# Altium schematic sheet TPS65130.schdoc
size A2
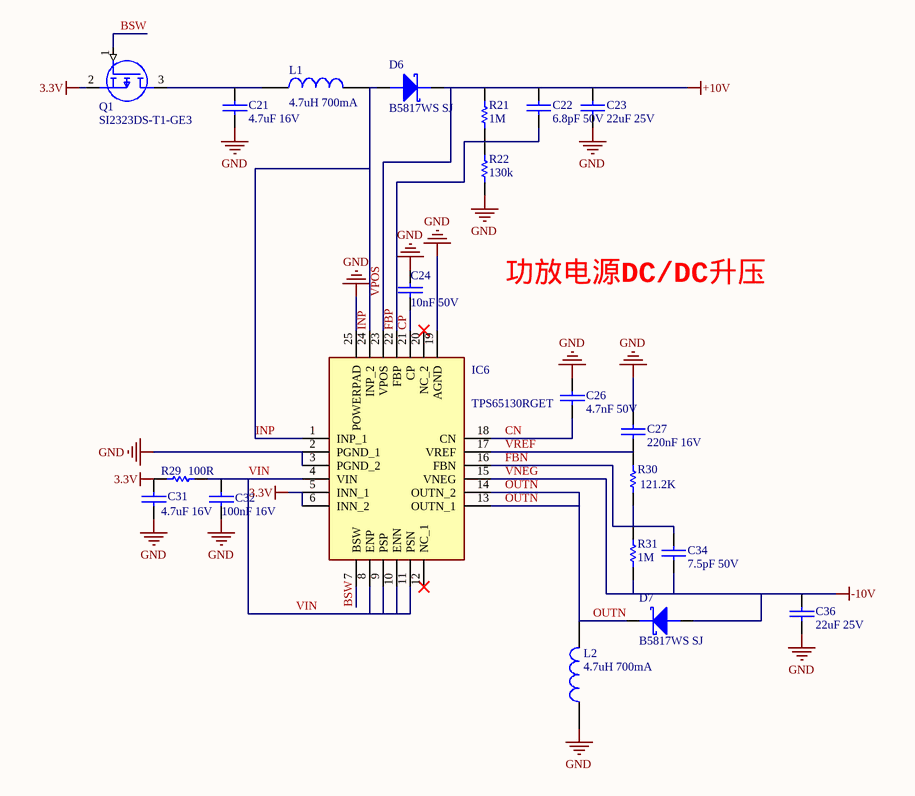
[diagram p0: TPS65130.schdoc]

## Parts
C21  4.7uF 16V  [0603C]
C22  6.8pF 50V  [0402C]
C23  22uF 25V  [0805C]
C24  10nF 50V  [0402C]
C26  4.7nF 50V  [0402C]
C27  220nF 16V  [0402C]
C31  4.7uF 16V  [0603C]
C32  100nF 16V  [0402C]
C34  7.5pF 50V  [0402C]
C36  22uF 25V  [0805C]
D6  B5817WS SJ  [SOD-323]
D7  B5817WS SJ  [SOD-323]
IC6  TPS65130RGET  [QFN50P400X400X100-25N]
L1  4.7uH 700mA  [0805L]
L2  4.7uH 700mA  [0805L]
Q1  SI2323DS-T1-GE3  [SOT95P237X112-3N]
R21  1M  [0402R]
R22  130k  [0402R]
R29  100R  [0402R]
R30  121.2K  [0402R]
R31  1M  [0402R]

## Nets
3.3V: C31.2 IC6.5(INN_1) IC6.6(INN_2) Q1.2(S) R29.1
GND: C21.1 C23.2 C24.1 C26.1 C27.2 C31.1 C32.2 C36.2 IC6.2(PGND_1) IC6.3(PGND_2) IC6.19(AGND) IC6.25(POWERPAD) L2.1 R22.1
VNEG: C34.1 C36.1 D7.A IC6.15(VNEG) R31.1  [also labelled -10V]
VPOS: C22.2 C23.1 D6.K IC6.23(VPOS) R21.2  [also labelled +10V]
BSW: IC6.7(BSW) Q1.1(G)
CN: C26.2 IC6.18(CN)
CP: C24.2 IC6.21(CP)
FBN: C34.2 IC6.16(FBN) R30.1 R31.2
FBP: C22.1 IC6.22(FBP) R21.1 R22.2
INP: D6.A IC6.1(INP_1) IC6.24(INP_2) L1.2
OUTN: D7.K IC6.13(OUTN_1) IC6.14(OUTN_2) L2.2
VIN: C32.1 IC6.4(VIN) IC6.8(ENP) IC6.9(PSP) IC6.10(ENN) IC6.11(PSN) R29.2
VREF: C27.1 IC6.17(VREF) R30.2
NetC21_2: C21.2 L1.1 Q1.3(D)

Not connected (* = marked no-connect by the designer): IC6 12(NC_1)* 20(NC_2)*

## Notes on the sheet
- 功放电源DC/DC升压

## Library data of the parts
C21-C24 C26 C27 C31 C34 C36 = CAP-NP
C32 = CAP-NP: Manufacturer 1: Samsung; Manufacturer Part Number 1: CL05B104KO5NNNC; Description 1: CAP CER 0.1UF 16V X7R 0402; Material: Ceramic; Tolerance: 10%; Dielectric: X7R; Supplier 1: LCSC; Supplier Part Number 1: C1525; Stock 1: 5012200; Pricing 1: 100=0.0023, 1000=0.002, 3000=0.0018, 10000=0.0017, 50000=0.0017, 100000=0.0017, 100=0.0021, 1000=0.0018, 3000=0.0017, 10000=0.0016, 50000=0.0016, 100000=0.0016, 100=0.0107, 1000=0.0094, 3000=0.0087, 10000=0.008, 50000=0.008, 100000=0.008, 100=0.0102, 1000=0.0089, 3000=0.0083, 10000=0.0077, 50000=0.0077, 100000=0.0077, 100=0.0014, 1000=0.0012, 3000=0.0011, 10000=0.001, 50000=0.001, 100000=0.001, 100=0.0012, 1000=0.0011, 3000=0.001, 10000=0.0009, 50000=0.0009, 100000=0.0009, 100=0.0124, 1000=0.0109, 3000=0.0101, 10000=0.0093, 50000=0.0093, 100000=0.0093, 100=0.1676, 1000=0.1466, 3000=0.1361, 10000=0.1257, 50000=0.1257, 100000=0.1257, 100=0.0066, 1000=0.0058, 3000=0.0054, 10000=0.005, 50000=0.005, 100000=0.005, 100=0.1289, 1000=0.1128, 3000=0.1048, 10000=0.0967, 50000=0.0967, 100000=0.0967, 100=0.0142, 1000=0.0125, 3000=0.0116, 10000=0.0107, 50000=0.0107, 100000=0.0107, 100=0.0022, 1000=0.0019, 3000=0.0018, 10000=0.0016, 50000=0.0016, 100000=0.0016, 100=0.0016, 1000=0.0014, 3000=0.0013, 10000=0.0012, 50000=0.0012, 100000=0.0012 (AUD); Mount: Surface Mount; Case/Package: 0402; Case Code (Metric): 1005; Case Code (Imperial): 0402; Contact Plating: Tin; Min Operating Temperature: -55°C; Max Operating Temperature: 125°C; Capacitance: 100nF; Packaging: Tape and Reel; Voltage Rating: 16V; Voltage Rating (DC): 16V; Package Quantity: 1; Voltage: 16V; Length: 1mm; Width: 0.02inch; Height 1: 0.5mm; Thickness: 0.022inch; Depth: 0.5mm; Radiation Hardening: No; Lead Free: Lead Free; ComponentLink1URL: http://www1.futureelectronics.com/doc/SAMSUNG%20PASSIVE/CL05B104KQ5NNNC.pdf?src-supplier=Future+Electronics; ComponentLink1Description: http://www1.futureelectronics.com/doc/SAMSUNG%20PASSIVE/CL05B104KQ5NNNC.pdf?src-supplier=Future+Electronics; ComponentLink2URL: https://www.verical.com/server-webapp/html/getDatasheet?partID=359683&src-supplier=Verical; ComponentLink2Description: https://www.verical.com/server-webapp/html/getDatasheet?partID=359683&src-supplier=Verical; ComponentLink3URL: https://www.distrelec.biz/Web/Downloads/_e/ng/MLCC_CatalogDownload2013_ENG.pdf?mime=application%2Fpdf&src-supplier=Distrelec; ComponentLink3Description: https://www.distrelec.biz/Web/Downloads/_e/ng/MLCC_CatalogDownload2013_ENG.pdf?mime=application%2Fpdf&src-supplier=Distrelec; ComponentLink4URL: https://produktinfo.conrad.com/datenblaetter/450000-474999/458718-da-01-en-VS_KONDENSATOR_0402.pdf?src-supplier=Conrad; ComponentLink4Description: https://produktinfo.conrad.com/datenblaetter/450000-474999/458718-da-01-en-VS_KONDENSATOR_0402.pdf?src-supplier=Conrad
D6 D7 = DIODE SCHOTTKY: 肖特基二极管
IC6 = TPS65131RGET: DC/DC 芯片; Manufacturer_Name: Texas Instruments; Datasheet Link: http://www.ti.com/lit/ds/symlink/tps65130.pdf; Height: 1mm; Manufacturer_Part_Number: TPS65131RGET; Arrow Part Number: TPS65130RGET; Arrow Price/Stock: https://www.arrow.com/en/products/tps65131rget/texas-instruments; Mouser Part Number: 595-TPS65131RGET; Mouser Price/Stock: https://www.mouser.co.uk/ProductDetail/Texas-Instruments/TPS65131RGET?qs=Gse6rAGbi7%2FStiVl23F5Fg%3D%3D
L1 L2 = INDUCTOR: MLP2012S4R7MT0S1
Q1 = SI2323DS-T1-GE3: MOSFET (P-Channel); Manufacturer_Name: Vishay; Datasheet Link: https://mouser.componentsearchengine.com/Datasheets/2/SI2323DS-T1-GE3.pdf; Height: 1.12mm; Manufacturer_Part_Number: SI2323DS-T1-GE3; Arrow Part Number: SI2323DS-T1-GE3; Arrow Price/Stock: https://www.arrow.com/en/products/si2323ds-t1-ge3/vishay; Mouser Part Number: 781-SI2323DS-T1-GE3; Mouser Price/Stock: https://www.mouser.co.uk/ProductDetail/Vishay-Semiconductors/SI2323DS-T1-GE3?qs=IRuQNBqMOcnPRxUlCX6ywQ%3D%3D
R21 R22 R29-R31 = RES